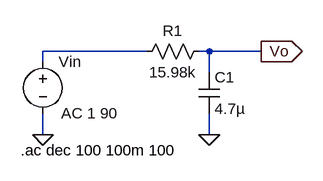
[diagram p0: schematic filter.asc]
filter.asc, the LTspice schematic file:
Version 4
SHEET 1 880 680
WIRE 272 64 112 64
WIRE 368 64 352 64
WIRE 448 64 368 64
WIRE 112 80 112 64
WIRE 368 96 368 64
WIRE 112 192 112 160
WIRE 368 192 368 160
FLAG 112 192 0
FLAG 368 192 0
FLAG 448 64 Vo
IOPIN 448 64 Out
SYMBOL voltage 112 64 R0
WINDOW 123 28 95 Left 2
WINDOW 39 0 0 Left 0
SYMATTR InstName Vin
SYMATTR Value ""
SYMATTR Value2 AC 1 90
SYMBOL res 256 80 R270
WINDOW 0 32 56 VTop 2
WINDOW 3 0 56 VBottom 2
SYMATTR InstName R1
SYMATTR Value 15.98k
SYMBOL cap 352 96 R0
SYMATTR InstName C1
SYMATTR Value 4.7µ
TEXT 78 216 Left 2 !.ac dec 100 100m 100

The netlist it stands for:
* filter.asc
Vin N001 0 AC 1 90
R1 N001 Vo 15.98k
C1 Vo 0 4.7µ
.ac dec 100 100m 100
.backanno
.end